# EAGLE design breakout (EAGLE 9.6.2)
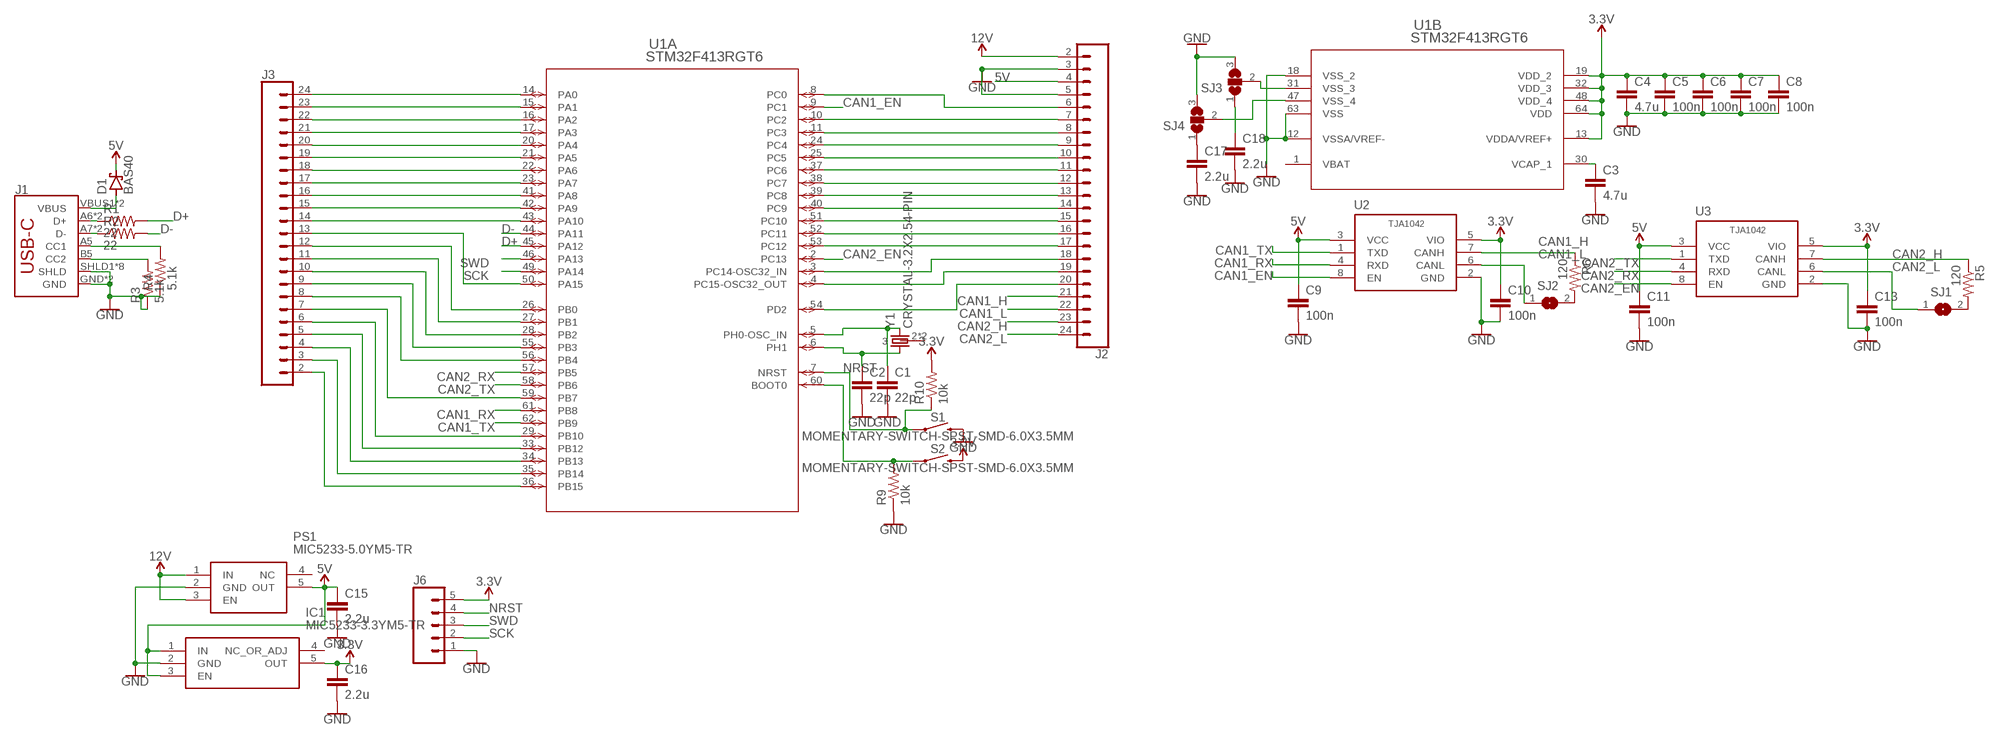
[diagram p0: schematic, sheet 1]

## Parts
C1  22p  C0603  [0603-C]
C2  22p  C0603  [0603-C]
C3  4.7u  C0603  [0603-C]
C4  4.7u  C0603  [0603-C]
C5  100n  C0603  [0603-C]
C6  100n  C0603  [0603-C]
C7  100n  C0603  [0603-C]
C8  100n  C0603  [0603-C]
C9  100n  C0603  [0603-C]
C10  100n  C0603  [0603-C]
C11  100n  C0603  [0603-C]
C13  100n  C0603  [0603-C]
C15  2.2u  C0603  [0603-C]
C16  2.2u  C0603  [0603-C]
C17  2.2u  C0603  [0603-C]
C18  2.2u  C0603  [0603-C]
D1  BAS40  [SOT23]
IC1  MIC5233-3.3YM5-TR  [SOT95P280X145-5N]
J1  USB-C-BREAKOUT_SPARKFUN-CONNECTORS_USB_C16PIN  [USB-C-BREAKOUT_SPARKFUN-CONNECTORS_USB-C-16P]
J2  CONN_23  [1X23]
J3  CONN_23  [1X23]
J6  CONN_05  [1X05]
PS1  MIC5233-5.0YM5-TR  [SOT95P280X145-5N]
R1  22  R0402  [0402-R]
R2  22  R0402  [0402-R]
R3  5.1k  R0402  [0402-R]
R4  5.1k  R0402  [0402-R]
R5  120  R0402  [0402-R]
R6  120  R0402  [0402-R]
R9  10k  R0402  [0402-R]
R10  10k  R0402  [0402-R]
S1  MOMENTARY-SWITCH-SPST-SMD-6.0X3.5MM  [TACTILE_SWITCH_SMD_6.0X3.5MM]
S2  MOMENTARY-SWITCH-SPST-SMD-6.0X3.5MM  [TACTILE_SWITCH_SMD_6.0X3.5MM]
SJ1  SJ  [SJ]
SJ2  SJ  [SJ]
SJ3  SJ2W  [SJ_2]
SJ4  SJ2W  [SJ_2]
U1  STM32F413RGT6  [LQFP64-10X10MM]
U2  TJA1042  [NXP_SEMICONDUCTORS_TJA1042T-3-CM_118_0]
U3  TJA1042  [NXP_SEMICONDUCTORS_TJA1042T-3-CM_118_0]
Y1  CRYSTAL-3.2X2.54-PIN  [XTAL-3.2X2.5]

## Nets
3.3V: C4.1 C5.1 C6.1 C7.1 C8.1 C10.1 C13.1 C16.1 IC1.5(OUT) J6.5 R10.2 S2.2 U1.13(B:VDDA/VREF+) U1.19(B:VDD_2) U1.32(B:VDD_3) U1.48(B:VDD_4) U1.64(B:VDD) U2.5(VIO) U3.5(VIO)
5V: C9.1 C11.1 C15.1 D1.3(C) IC1.1(IN) IC1.3(EN) J2.4 PS1.5(OUT) U2.3(VCC) U3.3(VCC)
12V: J2.2 PS1.1(IN) PS1.3(EN)
CAN1_EN: U1.9(A:PC1) U2.8(EN)
CAN1_H: J2.21 R6.1 U2.7(CANH)
CAN1_L: J2.22 SJ2.1 U2.6(CANL)
CAN1_RX: U1.61(A:PB8) U2.4(RXD)
CAN1_TX: U1.62(A:PB9) U2.1(TXD)
CAN2_EN: U1.2(A:PC13) U3.8(EN)
CAN2_H: J2.23 R5.1 U3.7(CANH)
CAN2_L: J2.24 SJ1.1 U3.6(CANL)
CAN2_RX: U1.57(A:PB5) U3.4(RXD)
CAN2_TX: U1.58(A:PB6) U3.1(TXD)
D+: R1.2 U1.45(A:PA12)
D-: R2.2 U1.44(A:PA11)
GND: C1.2 C2.2 C3.2 C4.2 C5.2 C6.2 C7.2 C8.2 C9.2 C10.2 C11.2 C13.2 C15.2 C16.2 C17.2 C18.2 IC1.2(GND) J1.GND J1.GND2(GND) J1.SHLD1(SHLD) J1.SHLD2(SHLD) J1.SHLD3(SHLD) J1.SHLD4(SHLD) J1.SHLD5(SHLD) J1.SHLD6(SHLD) J1.SHLD7(SHLD) J1.SHLD8(SHLD) J2.3 J2.5 J6.1 PS1.2(GND) R3.1 R4.1 R9.1 S1.2 SJ3.3 SJ4.3 U1.12(B:VSSA/VREF-) U1.18(B:VSS_2) U1.63(B:VSS) U2.2(GND) U3.2(GND)
N$1: C1.1 U1.5(A:PH0-OSC_IN) Y1.3
N$2: C2.1 U1.6(A:PH1) Y1.1
N$3: J3.24 U1.14(A:PA0)
N$4: J3.23 U1.15(A:PA1)
N$5: D1.1(A) J1.VBUS1(VBUS) J1.VBUS2(VBUS)
N$6: J1.A5(CC1) R4.2
N$7: J1.B5(CC2) R3.2
N$8: C17.1 SJ4.1
N$9: R9.2 S2.1 U1.60(A:BOOT0)
N$10: J1.A6(D+) J1.B6(D+) R1.1
N$11: J1.A7(D-) J1.B7(D-) R2.1
N$12: R5.2 SJ1.2
N$13: C3.1 U1.30(B:VCAP_1)
N$14: J3.22 U1.16(A:PA2)
N$15: SJ3.2 U1.31(B:VSS_3)
N$16: SJ4.2 U1.47(B:VSS_4)
N$17: C18.1 SJ3.1
N$18: J3.21 U1.17(A:PA3)
N$19: J3.20 U1.20(A:PA4)
N$20: J3.19 U1.21(A:PA5)
N$21: J3.18 U1.22(A:PA6)
N$22: J3.17 U1.23(A:PA7)
N$23: J3.16 U1.41(A:PA8)
N$24: J3.15 U1.42(A:PA9)
N$25: J3.14 U1.43(A:PA10)
N$26: J3.13 U1.50(A:PA15)
N$27: J3.12 U1.26(A:PB0)
N$28: J3.11 U1.27(A:PB1)
N$29: J3.10 U1.28(A:PB2)
N$30: J3.9 U1.55(A:PB3)
N$31: J3.8 U1.56(A:PB4)
N$32: J3.7 U1.59(A:PB7)
N$33: J3.6 U1.29(A:PB10)
N$34: J3.5 U1.33(A:PB12)
N$35: J3.4 U1.34(A:PB13)
N$36: J3.3 U1.35(A:PB14)
N$37: J3.2 U1.36(A:PB15)
N$38: J2.20 U1.54(A:PD2)
N$39: J2.19 U1.4(A:PC15-OSC32_OUT)
N$40: J2.18 U1.3(A:PC14-OSC32_IN)
N$41: J2.17 U1.53(A:PC12)
N$42: J2.16 U1.52(A:PC11)
N$43: J2.15 U1.51(A:PC10)
N$44: J2.14 U1.40(A:PC9)
N$45: J2.13 U1.39(A:PC8)
N$46: J2.12 U1.38(A:PC7)
N$47: J2.11 U1.37(A:PC6)
N$48: J2.10 U1.25(A:PC5)
N$49: J2.9 U1.24(A:PC4)
N$50: J2.8 U1.11(A:PC3)
N$51: J2.7 U1.10(A:PC2)
N$52: J2.6 U1.8(A:PC0)
N$53: R6.2 SJ2.2
NRST: J6.4 R10.1 S1.1 U1.7(A:NRST)
SCK: J6.2 U1.49(A:PA14)
SWD: J6.3 U1.46(A:PA13)
Unconnected: IC1.4(NC_OR_ADJ) PS1.4(NC) Y1.2 Y1.4

## Power pins joined to a net without a drawn wire
VBAT: U1.1(B:VBAT)

## Library data of the parts
C1-C11 C13 C15-C18 = comma.ai:C
D1 = diode:BAS40: Silicon Schottky Diodes General-purpose diode for high-speed switching
IC1 = SamacSys_Parts:MIC5233-3.3YM5-TR: High Input Voltage Low IQ UCAP LDO Regulator Source: Datasheet <http://ww1.microchip.com/downloads/en/DeviceDoc/MIC5233-Data-Sheet-DS20006033D.pdf>; DESCRIPTION: High Input Voltage Low IQ UCAP LDO Regulator; HEIGHT: 1.45mm; MANUFACTURER_NAME: Microchip; MANUFACTURER_PART_NUMBER: MIC5233-3.3YM5-TR; MOUSER_PART_NUMBER: 998-MIC5233-3.3YM5TR; MOUSER_PRICE-STOCK: https://www.mouser.co.uk/ProductDetail/Microchip-Technology-Micrel/MIC5233-33YM5-TR?qs=U6T8BxXiZAWDhshLMgpaLQ%3D%3D
J1 = ROTR-Wireless:USB-C-BREAKOUT_SPARKFUN-CONNECTORS_USB_C: USB Type C 16Pin Connector Super Speed pins not available on the 16-pin purely SMD connector so this part is best for USB 2.0 implementations. D1 and D2 are tied together enabling D+/- no matter which way the cable is plugged into the connector. The two channel configuration pins (CC1/2) are exposed. These are normally connected to ground via 5.1k resistors but can be reconfigured for high current/high power applications.; PROD_ID: CONN-14122
J2 J3 = SparkFun-Connectors:CONN_23: Multi connection point. Often used as Generic Header-pin footprint for 0.1 inch spaced/style header connections On any of the 0.1 inch spaced packages, you can populate with these: Break Away Headers - Straight <https://www.sparkfun.com/products/116> (PRT-00116) Break Away Male Headers - Right Angle <https://www.sparkfun.com/products/553> (PRT-00553) Female Headers <https://www.sparkfun.com/products/115> (PRT-00115) Break Away Headers - Machine Pin <https://www.sparkfun.com/products/117> (PRT-00117) Break Away Female Headers - Swiss Machine Pin <https://www.sparkfun.com/products/743> (PRT-00743) For SCREWTERMINALS and SPRING TERMINALS visit here: Screw Terimnals on SparkFun.com <https://www.sparkfun.com/search/results?term=Screw+Terminals> (5mm/3.5mm/2.54mm spacing) This device is also useful as a general connection point to wire up your design to another part of your project. Our various solder wires solder well into these plated through hole pads. Hook-Up Wire - Assortment (Stranded, 22 AWG) <https://www.sparkfun.com/products/11375> (PRT-11375) Hook-Up Wire - Assortment (Solid Core, 22 AWG) <https://www.sparkfun.com/products/11367> (PRT-11367) View the entire wire category on our website here <https://www.sparkfun.com/categories/141> Special notes: Molex polarized connector foot print use with SKU : PRT-08231 with associated crimp pins and housings. 1MM SMD Version SKU: PRT-10208 NOTES ON THE VARIANTS LOCK and LOCK_LONGPADS... This footprint was designed to help hold the alignment of a through-hole component (i.e. 6-pin header) while soldering it into place. You may notice that each hole has been shifted either up or down by 0.005 of an inch from it's more standard position (which is a perfectly straight line). This slight alteration caused the pins (the squares in the middle) to touch the edges of the holes. Because they are alternating, it causes a "brace" to hold the component in place. 0.005 has proven to be the perfect amount of "off-center" position when using our standard breakaway headers. Although looks a little odd when you look at the bare footprint, once you have a header in there, the alteration is very hard to notice. Also,if you push a header all the way into place, it is covered up entirely on the bottom side.
J6 = SparkFun-Connectors:CONN_05: Multi connection point. Often used as Generic Header-pin footprint for 0.1 inch spaced/style header connections On any of the 0.1 inch spaced packages, you can populate with these: Break Away Headers - Straight <https://www.sparkfun.com/products/116> (PRT-00116) Break Away Male Headers - Right Angle <https://www.sparkfun.com/products/553> (PRT-00553) Female Headers <https://www.sparkfun.com/products/115> (PRT-00115) Break Away Headers - Machine Pin <https://www.sparkfun.com/products/117> (PRT-00117) Break Away Female Headers - Swiss Machine Pin <https://www.sparkfun.com/products/743> (PRT-00743) For SCREWTERMINALS and SPRING TERMINALS visit here: Screw Terimnals on SparkFun.com <https://www.sparkfun.com/search/results?term=Screw+Terminals> (5mm/3.5mm/2.54mm spacing) This device is also useful as a general connection point to wire up your design to another part of your project. Our various solder wires solder well into these plated through hole pads. Hook-Up Wire - Assortment (Stranded, 22 AWG) <https://www.sparkfun.com/products/11375> (PRT-11375) Hook-Up Wire - Assortment (Solid Core, 22 AWG) <https://www.sparkfun.com/products/11367> (PRT-11367) View the entire wire category on our website here <https://www.sparkfun.com/categories/141> Special notes: Molex polarized connector foot print use with SKU : PRT-08231 with associated crimp pins and housings. 1MM SMD Version SKU: PRT-10208
PS1 = SamacSys_Parts:MIC5233-5.0YM5-TR: MICROCHIP - MIC5233-5.0YM5-TR - LDO, REG, 36VIN, 0.1A, 5V, 2%, 5SOT23 Source: Datasheet <https://componentsearchengine.com/Datasheets/2/MIC5233-5.0YM5-TR.pdf>; DESCRIPTION: MICROCHIP - MIC5233-5.0YM5-TR - LDO, REG, 36VIN, 0.1A, 5V, 2%, 5SOT23; HEIGHT: 1.45mm; MANUFACTURER_NAME: Microchip; MANUFACTURER_PART_NUMBER: MIC5233-5.0YM5-TR; MOUSER_PART_NUMBER: 998-MIC5233-5.0YM5TR; MOUSER_PRICE-STOCK: https://www.mouser.co.uk/ProductDetail/Microchip-Technology-Micrel/MIC5233-50YM5-TR?qs=U6T8BxXiZAWSnpCHgrMajw%3D%3D
R1-R6 R9 R10 = comma.ai:R
S1 S2 = SparkFun-Switches:MOMENTARY-SWITCH-SPST: Momentary Switch (Pushbutton) - SPST Normally-open (NO) SPST momentary switches (buttons, pushbuttons). Variants PTH-12MM - 12mm square, through-hole Momentary Pushbutton Switch - 12mm Square <https://www.sparkfun.com/products/9190> (COM-09190) PTH-6.0MM, PTH-6.0MM-KIT - 6.0mm square, through-hole Mini Pushbutton Switch <https://www.sparkfun.com/products/97> (COM-00097) KIT package intended for soldering kit's - only one side of pads' copper is exposed. PTH-RIGHT-ANGLE-KIT - Right-angle, through-hole Right Angle Tactile Button <https://www.sparkfun.com/products/10791> - Used on SparkFun BigTime Watch Kit <https://www.sparkfun.com/products/11734> SMD-12MM - 12mm square, surface-mount Tactile Button - SMD (12mm) <https://www.sparkfun.com/products/12993> (COM-12993) Used on SparkFun PicoBoard <https://www.sparkfun.com/products/11888> SMD-4.5MM - 4.5mm Square Trackball Switch Used on SparkFun Blackberry Trackballer Breakout <https://www.sparkfun.com/products/13169> SMD-4.6MMX2.8MM - 4.60mm x 2.80mm, surface mount Used on SparkFun SAMD21 Mini Breakout <https://www.sparkfun.com/products/13664> SMD-5.2MM, SMD-5.2-REDUNDANT - 5.2mm square, surface-mount Mini Pushbutton Switch - SMD <https://www.sparkfun.com/products/8720> (COM-08720) Used on Arduino Pro Mini <https://www.sparkfun.com/products/11114> REDUNDANT package connects both switch circuits together SMD-6.0X3.5MM - 6.0 x 3.5mm, surface mount Momentary Reset Switch SMD <https://www.sparkfun.com/products/8229> (COM-08229) SMD-6.2MM-TALL - 6.2mm square, surface mount Tactile Button - SMD (6mm) <https://www.sparkfun.com/products/12992> Used on SparkFun Digital Sandbox <https://www.sparkfun.com/products/12651> SMD-RIGHT-ANGLE - Right-angle, surface mount Used on SparkFun Block for Intel® Edison - Arduino <https://www.sparkfun.com/products/13036>; PROD_ID: SWCH-00815; SF_SKU: COM-08229
SJ1 SJ2 = jumper:SJ: SMD solder JUMPER
SJ3 SJ4 = jumper:SJ2W: SMD solder JUMPER
U1 = interceptor:STM32F413RGT6; BUILT_BY: EMA_UL_Team; COPYRIGHT: Copyright (C) 2018 Accelerated Designs. All rights reserved; MANUFACTURER_PART_NUMBER: STM32F413RGT6; SOURCELIBRARY: Updates_to_database_2020-10-19; VENDOR: STMicroelectronics
U2 U3 = CM,118:TJA1042
Y1 = comma.ai:CRYSTAL-3.2X2.5

## Board
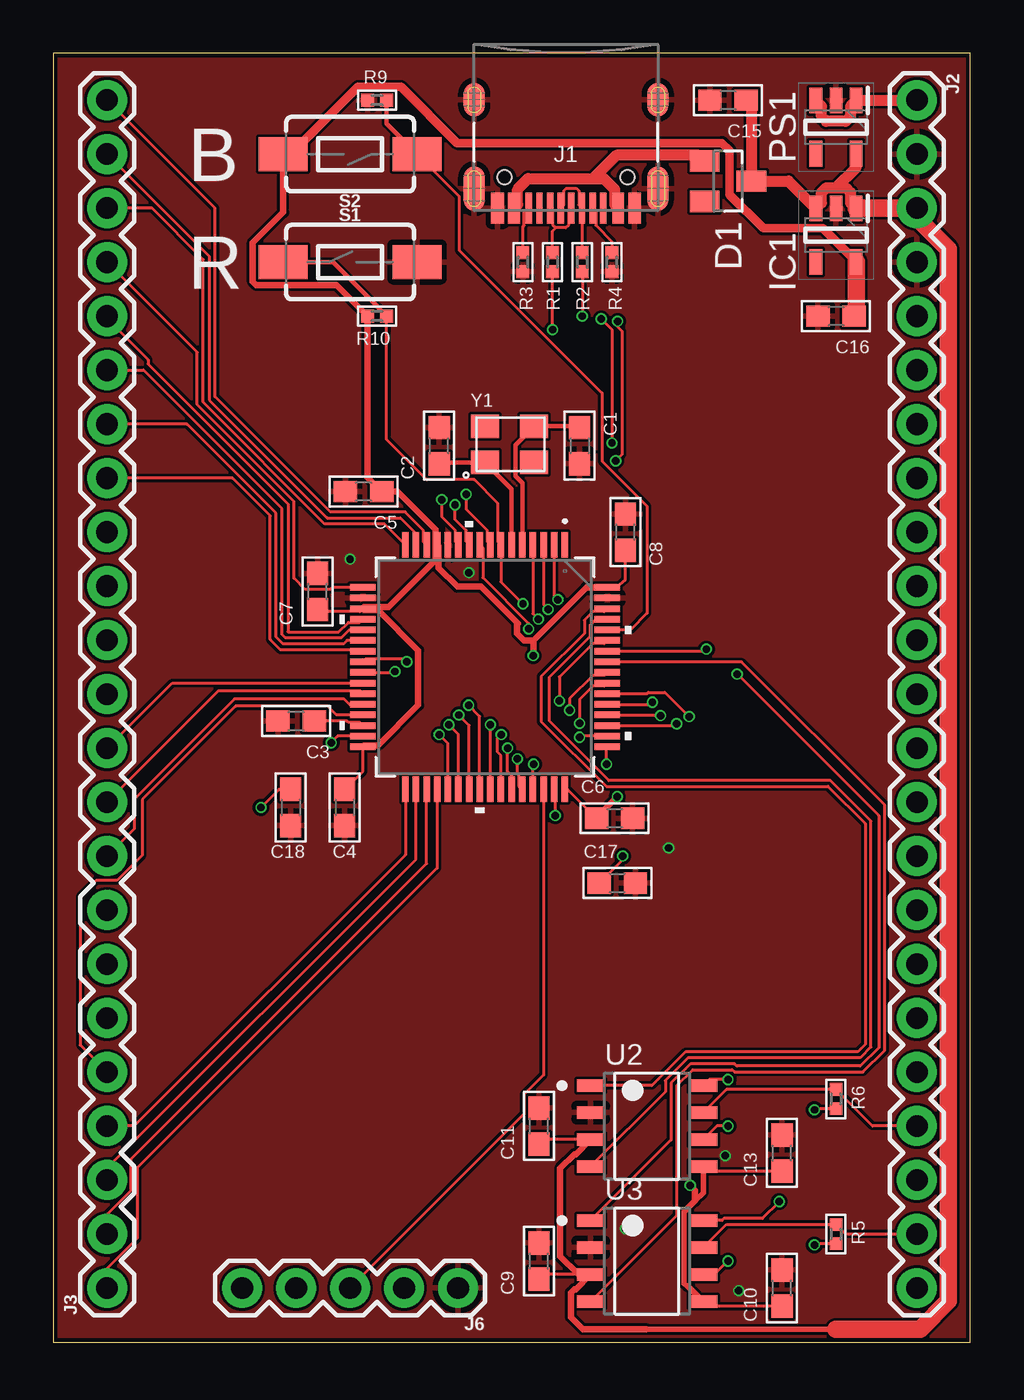
[diagram p1: board, top side]
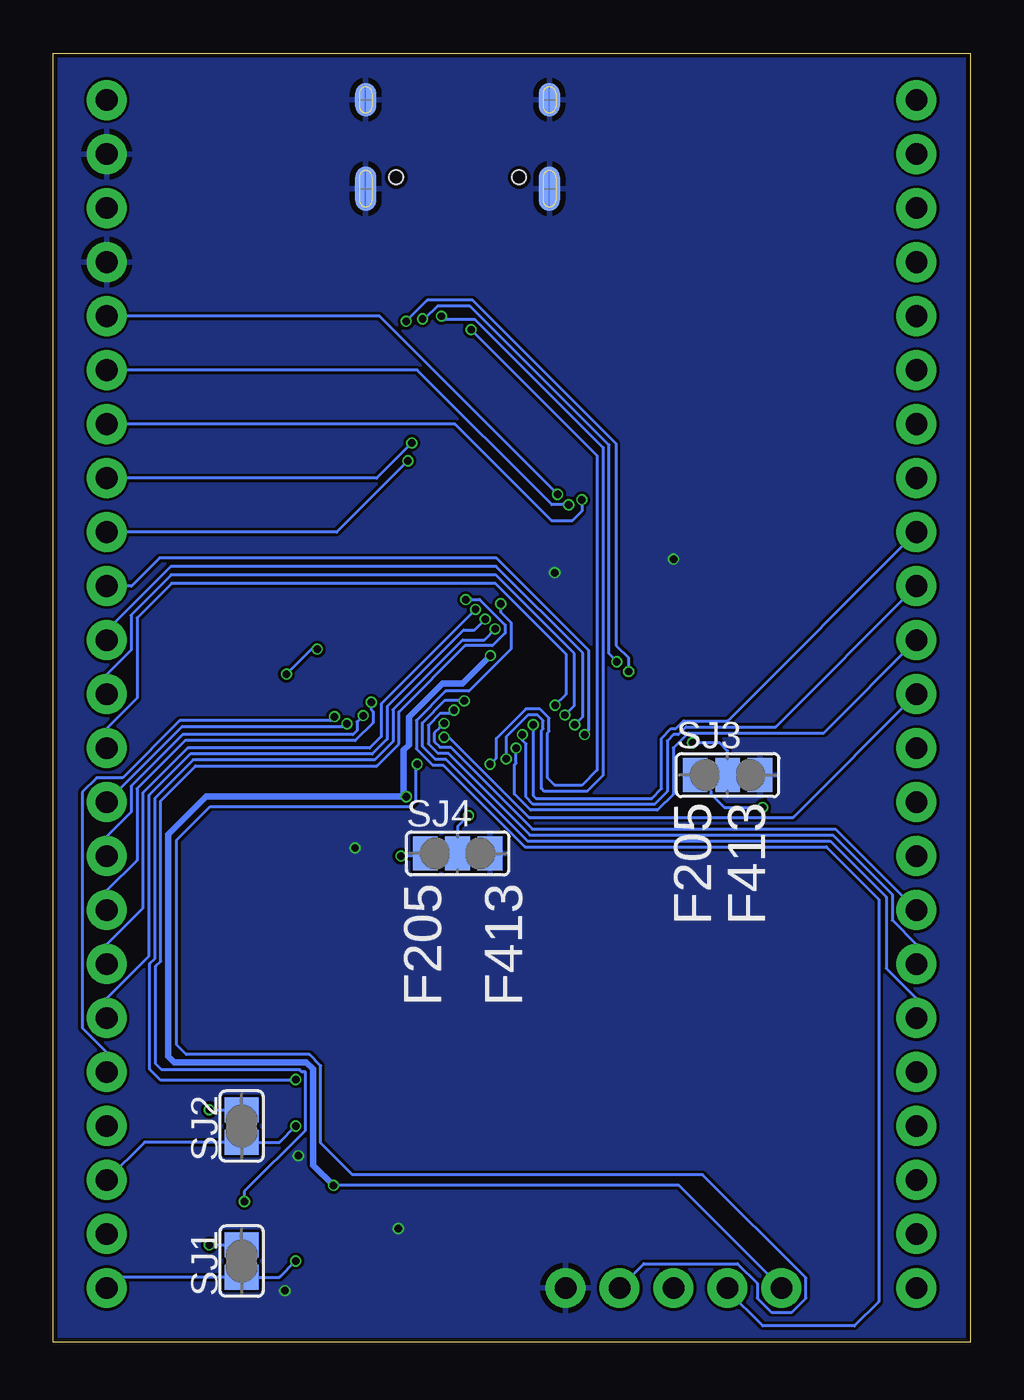
[diagram p2: board, bottom side, seen from below]

Size 43.16 x 60.63 mm. Coordinates in mm from the lower left corner, seen from the top.
Outline: 0,0 43.16,0 43.16,60.63 0,60.63 0,0
Copper layers (1*16): Top 0.035559375mm / dielectric 1.6mm / Bottom 0.035559375mm
Design rules "jlcpcb2layer": minimum track width 5mil, minimum drill 12mil, track to track 5mil, track to pad 5mil, pad to pad 5mil, via to via 5mil, smd to smd 5mil, copper to edge 8mil, drill to drill 6mil, minimum pad ring 5mil, minimum via ring 3mil, stop-mask expansion 2.5mil, vias tented up to drill 0mil, thermal gap 10mil

### Footprints (pad centres in the part's own frame; a part is rotated, then mirrored left to right if it is on the bottom)
0603-C = smd 1.1 x 1: 1 -0.85,0; 2 0.85,0
SOT23 = smd 1 x 1.4: 1 -0.95,-1.1; 2 0.95,-1.1; 3 0,1.1
SOT95P280X145-5N = smd 1.2 x 0.6: 1 -1.25,0.95; 2 -1.25,0; 3 -1.25,-0.95; 4 1.25,-0.95; 5 1.25,0.95
USB-C-BREAKOUT_SPARKFUN-CONNECTORS_USB-C-16P = smd 0.3 x 1.45: A5 -1.25,0; A6 -0.25,0; A7 0.25,0; A8 1.25,0; B5 1.75,0; B6 0.75,0; B7 -0.75,0; B8 -1.75,0 | smd 0.6 x 1.45: GND -3.225,0; GND2 3.225,0 | smd 1 x 2.1: SHLD1 -4.32,-0.915; SHLD2 4.32,-0.915 | smd 1 x 2.1 bottom: SHLD3 -4.32,-0.915; SHLD4 4.32,-0.915 | smd 1 x 1.6: SHLD5 -4.32,-5.095; SHLD8 4.32,-5.095 | smd 1 x 1.6 bottom: SHLD6 -4.32,-5.095; SHLD7 4.32,-5.095 | smd 0.55 x 1.45: VBUS1 -2.45,0; VBUS2 2.45,0 | hole 0.65: -2.89,-1.445; 2.89,-1.445
1X23 = drill 1.016 pad 1.88: 2 -26.67,0; 3 -24.13,0; 4 -21.59,0; 5 -19.05,0; 6 -16.51,0; 7 -13.97,0; 8 -11.43,0; 9 -8.89,0; 10 -6.35,0; 11 -3.81,0; 12 -1.27,0; 13 1.27,0; 14 3.81,0; 15 6.35,0; 16 8.89,0; 17 11.43,0; 18 13.97,0; 19 16.51,0; 20 19.05,0; 21 21.59,0; 22 24.13,0; 23 26.67,0; 24 29.21,0
1X05 = drill 1.016 pad 1.88: 1 0,0; 2 2.54,0; 3 5.08,0; 4 7.62,0; 5 10.16,0
0402-R = smd 0.6 x 0.6: 1 -0.45,0; 2 0.45,0
TACTILE_SWITCH_SMD_6.0X3.5MM = smd 2.3 x 1.6: 1 -3.15,0; 2 3.15,0
SJ = smd 1.168 x 1.6: 1 -0.762,0; 2 0.762,0
SJ_2 = smd 1.168 x 1.6: 1 -1.524,0; 2 0,0; 3 1.524,0
LQFP64-10X10MM = smd 1.194 x 0.305: 1 -5.75,3.75; 2 -5.75,3.25; 3 -5.75,2.75; 4 -5.75,2.25; 5 -5.75,1.75; 6 -5.75,1.25; 7 -5.75,0.75; 8 -5.75,0.25; 9 -5.75,-0.25; 10 -5.75,-0.75; 11 -5.75,-1.25; 12 -5.75,-1.75; 13 -5.75,-2.25; 14 -5.75,-2.75; 15 -5.75,-3.25; 16 -5.75,-3.75; 33 5.75,-3.75; 34 5.75,-3.25; 35 5.75,-2.75; 36 5.75,-2.25; 37 5.75,-1.75; 38 5.75,-1.25; 39 5.75,-0.75; 40 5.75,-0.25; 41 5.75,0.25; 42 5.75,0.75; 43 5.75,1.25; 44 5.75,1.75; 45 5.75,2.25; 46 5.75,2.75; 47 5.75,3.25; 48 5.75,3.75 | smd 0.305 x 1.194: 17 -3.75,-5.75; 18 -3.25,-5.75; 19 -2.75,-5.75; 20 -2.25,-5.75; 21 -1.75,-5.75; 22 -1.25,-5.75; 23 -0.75,-5.75; 24 -0.25,-5.75; 25 0.25,-5.75; 26 0.75,-5.75; 27 1.25,-5.75; 28 1.75,-5.75; 29 2.25,-5.75; 30 2.75,-5.75; 31 3.25,-5.75; 32 3.75,-5.75; 49 3.75,5.75; 50 3.25,5.75; 51 2.75,5.75; 52 2.25,5.75; 53 1.75,5.75; 54 1.25,5.75; 55 0.75,5.75; 56 0.25,5.75; 57 -0.25,5.75; 58 -0.75,5.75; 59 -1.25,5.75; 60 -1.75,5.75; 61 -2.25,5.75; 62 -2.75,5.75; 63 -3.25,5.75; 64 -3.75,5.75
NXP_SEMICONDUCTORS_TJA1042T-3-CM_118_0 = smd 1.3 x 0.6: 1 -2.65,1.905; 2 -2.65,0.635; 3 -2.65,-0.635; 4 -2.65,-1.905; 5 2.65,-1.905; 6 2.65,-0.635; 7 2.65,0.635; 8 2.65,1.905
XTAL-3.2X2.5 = smd 1.3 x 1.1: 1 0,-1.8; 2 2.3,-1.8; 3 2.3,-0.1; 4 0,-0.1

### Placement (x,y rotation side)
C1  24.77,42.16 270 top
C2  18.16,42.16 90 top
C3  11.43,29.21 180 top
C4  13.72,25.15 270 top
C5  14.61,40.01 180 top
C6  26.42,24.64 0 top
C7  12.45,35.31 90 top
C8  26.92,38.1 90 top
C9  22.86,3.81 90 top
C10  34.29,2.54 90 top
C11  22.86,10.16 90 top
C13  34.29,8.89 90 top
C15  31.75,58.42 180 top
C16  36.83,48.26 180 top
C17  26.54,21.59 0 top
C18  11.18,25.15 270 top
D1  31.75,54.61 270 top
IC1  36.83,52.07 270 top
J1  24.13,53.34 180 top
J2  40.64,31.75 270 top
J3  2.54,29.21 90 top
J6  19.05,2.54 180 top
PS1  36.83,57.15 270 top
R1  23.5,50.8 270 top
R2  24.89,50.8 270 top
R3  22.1,50.8 90 top
R4  26.29,50.8 90 top
R5  36.83,5.08 270 top
R6  36.83,11.43 270 top
R9  15.24,58.42 0 top
R10  15.24,48.26 180 top
S1  13.97,50.8 0 top
S2  13.97,55.88 180 top
SJ1  34.29,3.81 90 bottom
SJ2  34.29,10.16 90 bottom
SJ3  11.43,26.67 0 bottom
SJ4  24.13,22.99 0 bottom
U1  20.32,31.75 270 top
U2  27.94,10.16 0 top
U3  27.94,3.81 0 top
Y1  20.32,43.18 0 top

### Tracks (layer width: path | path; a pad name or v marks a point on that pad's centre or on a via)
3.3V  (via drill 0.35)
  Top 0.152: U1.19 14.43,34.36 12.55,34.36 C7.1 | C4.1 14.57,26.85 U1.32 | U1.64 26.48,35.5 26.92,35.87 C8.1 | C10.1 30.8,1.69 U3.5 | C13.1 30.8,8.04 U2.5 | C6.1 24.2,26 U1.48
  Top 0.254: U3.5 29.87,2.62 29.84,2.62 29.69,2.77 29.69,6.12 30.2,6.63 30.59,7.02 U2.5
  Top 0.305: U1.32 14.64,28.07 15.28,28.07 17.18,29.96 17.18,32.54 15.28,34.43 14.64,34.43 U1.19 14.64,34.57 15.78,34.57 18,36.79 18,37.43 U1.13 | U1.13 18,37.57 18,38.21 16.21,40.01 C5.1 14.79,40.67 R10.2 13.33,49.72 9.55,49.72 9.39,49.88 9.39,51.72 10.82,53.15 S2.2 | U1.13 18.14,37.43 18.14,36.41 19.02,35.53 20.14,35.53 21.86,33.8 21.82,33.77 21.82,33.32 22.14,33 22.59,33 | U1.64 25.09,35.5 22.59,33 | 30.2,6.63 30.2,7.14 v29.97,7.37 | v26.54,25.65 25.57,24.68 C6.1 | v22.59,32.29 22.59,33
  Top 0.406: IC1.5 36.21,52.39 33.4,52.39 31.82,53.97 31.82,56.06 31.47,56.41 19.01,56.41 16.37,59.05 14.35,59.05 11.18,55.88 S2.2
  Top 0.813: IC1.5 37.78,48.36 C16.1
  Bottom 0.152: J6.5 13.72,7.37 v29.97,7.37
  Bottom 0.305: v29.97,7.37 30.93,8.32 30.93,12.85 31.25,13.17 37.47,13.17 37.74,13.45 37.74,23.88 35.97,25.65 v26.54,25.65 26.67,25.78 26.67,27.85 26.42,28.1 26.42,29.39 24.84,30.98 23.9,30.98 v22.59,32.29
5V
  Top 0.152: U3.3 24.71,3.17 23.07,3.17 C9.1 | U2.3 23.07,9.53 C11.1
  Top 0.254: 27.89,0.61 36.83,0.61
  Top 0.305: 27.89,0.61 24.92,0.61 24.36,1.17 24.36,2.32 24.52,2.48 24.6,2.48 U3.3 | U2.3 24.6,8.83 24.52,8.83 23.85,8.16 23.85,4.03 24.71,3.17
  Top 0.508: 36.83,54.3 36.37,54.3 36.15,54.08 36.15,53.59 IC1.3 34.59,54.61 D1.3 32.85,58.17 C15.1 | 36.83,54.3 37.29,54.3 37.51,54.08 37.51,53.59 IC1.1 | 36.83,54.3 37.78,55.25 PS1.5
  Top 0.813: IC1.1 37.8,53.34 J2.4 40.64,52.88 42.11,51.41 42.11,1.93 40.79,0.61 36.83,0.61
12V
  Top 0.508: J2.2 37.8,58.42 PS1.1 37.51,58.13 37.51,57.64 37.29,57.42 36.37,57.42 36.15,57.64 36.15,58.13 PS1.3
CAN1_EN  (via drill 0.35)
  Top 0.152: U1.9 20.21,37.36 20.21,35.96 22.37,33.8 v22.37,33.54 | v31.75,12.35 30.87,12.35 U2.8
  Bottom 0.152: v22.37,33.54 22.87,33.03 23.89,33.03 27.17,29.75 27.17,28.25 28.04,27.38 36.58,27.38 38.38,25.58 38.38,18.03 38.61,17.8 38.61,12.83 38.1,12.32 31.78,12.32 v31.75,12.35
CAN1_H
  Top 0.152: J2.21 38.55,10.16 R6.1 31.68,11.88 U2.7
CAN1_L  (via drill 0.35)
  Top 0.152: v31.75,10.16 31.23,10.16 U2.6
  Bottom 0.152: J2.22 38.86,9.4 SJ2.1 32.51,9.4 v31.75,10.16
CAN1_RX
  Top 0.152: U1.61 25.53,34 25.27,33.74 25.27,33.21 23.35,31.29 23.35,29.2 26.14,26.42 36.58,26.42 38.48,24.51 38.48,13.88 37.97,13.37 29.87,13.37 28.8,12.3 28.8,11.76 U2.4
CAN1_TX
  Top 0.152: U1.62 25.93,34.36 25.39,34.36 24.99,33.96 24.99,33.33 22.96,31.3 22.96,29.2 26.02,26.14 36.45,26.14 38.2,24.38 38.2,14 37.85,13.65 29.75,13.65 28.17,12.06 U2.1
CAN2_EN  (via drill 0.35)
  Top 0.152: v23.75,34.92 23.57,35.1 U1.2 | v34.16,6.6 33.37,5.81 31.56,5.81 31.46,5.71 U3.8
  Bottom 0.152: v23.75,34.92 23.49,34.92 23.48,34.93 23.09,34.93 21.9,33.73 21.9,33.35 22.5,32.75 23.77,32.75 26.89,29.64 26.89,28.13 27.92,27.1 36.46,27.1 38.1,25.46 38.1,17.91 38.33,17.68 38.33,13.08 38.06,12.81 31.56,12.81 31.45,12.7 31.28,12.7 31.28,9.97 34.16,7.09 v34.16,6.6
CAN2_H
  Top 0.152: J2.23 37.28,5.08 R5.1 31.68,5.53 U3.7
CAN2_L  (via drill 0.35)
  Top 0.152: v31.75,3.81 31.11,3.17 U3.6
  Bottom 0.152: J2.24 40.13,3.05 SJ1.1 32.51,3.05 v31.75,3.81
CAN2_RX
  Top 0.152: U3.4 29.36,5.97 29.36,12.07 30.1,12.81 31.94,12.81 32.05,12.7 38.1,12.7 39.12,13.72 39.12,25.27 32.39,32 U1.57
CAN2_TX  (via drill 0.35)
  Top 0.152: U1.58 30.64,32.5 v30.73,32.59 | v32.18,31.42 38.84,24.77 38.84,13.84 37.97,12.98 32.17,12.98 32.06,13.09 29.98,13.09 29.08,12.18 29.08,9.5 U3.1
  Bottom 0.152: v32.18,31.42 31.01,32.59 v30.73,32.59
D+  (via drill 0.35)
  Top 0.152: U1.45 22.57,27.14 v22.61,27.18 | v23.5,47.62 R1.2
  Bottom 0.152: v23.5,47.62 17.57,41.7 17.57,26.91 18.29,26.19 19.56,26.19 19.91,26.54 19.91,28.65 19.83,28.73 19.83,29.35 20.27,29.79 20.93,29.79 22.31,28.4 22.31,27.47 v22.61,27.18
D-  (via drill 0.35)
  Top 0.152: U1.44 21.93,26.14 21.93,26.68 21.84,26.76 v21.84,27.43 | R2.2 v24.89,48.26
  Bottom 0.152: v24.89,48.26 24.72,48.09 23.3,48.09 17.29,42.08 17.29,26.65 18.03,25.91 20.07,25.91 20.19,26.04 20.19,28.76 20.11,28.85 20.11,29.23 20.38,29.51 20.81,29.51 21.84,28.47 v21.84,27.43
GND  (via drill 0.35)
  other vias: 13.97,36.83 19.56,36.2 32.26,2.41 31.62,8.76 26.92,5.33 28.96,23.24
  pour Top: 0,0 43.18,0 43.18,60.58 0,60.58
  pour Bottom: 0,0 43.18,0 43.18,60.58 0,60.58
N$1
  Top 0.203: C1.1 24.7,43.08 Y1.3 21.74,42.2 21.74,40.73 22.07,40.41 U1.5
N$2
  Top 0.203: C2.1 18.23,41.38 Y1.1 21.57,40.13 U1.6
N$3
  Top 0.152: U1.14 17.43,37.64 17.43,38.18 16.56,39.05 13.04,39.05 7.62,44.47 7.62,53.34 J3.24
N$4
  Top 0.152: J3.23 7.34,51.08 7.34,44.32 12.89,38.77 16.34,38.77 17.07,38.04 U1.15
N$5
  Top 0.508: J1.VBUS1 26.41,53.51 26.41,54.22 25.91,54.73 25.4,54.73 | J1.VBUS2 21.85,53.51 21.85,54.22 22.35,54.73 25.4,54.73 | D1.1 30.39,55.82 26.5,55.82 25.4,54.73
N$6
  Top 0.152: J1.A5 25.53,53.19 25.53,52.53 26.29,51.77 R4.2
N$7
  Top 0.152: R3.2 22.1,52.47 22.16,52.53 22.16,53.12 J1.B5
N$8  (via drill 0.35)
  Top 0.152: v26.8,22.86 26.8,22.69 C17.1
  Bottom 0.152: SJ4.1 25.78,22.86 v26.8,22.86
N$9
  Top 0.152: S2.1 19.11,53.89 19.11,51.35 25.82,44.64 25.82,41.44 27.94,39.32 27.94,34.29 27.15,33.5 U1.60
  Top 0.203: S2.1 15.69,57.31 R9.2
N$10
  Top 0.152: 23.65,52.41 24.11,52.41 24.23,52.53 24.23,53.19 J1.A6 | 23.65,52.41 23.53,52.53 23.53,53.19 J1.B6 | R1.1 23.5,52.26 23.65,52.41
N$11
  Top 0.152: J1.A7 24.03,53.49 24.03,54.15 24.15,54.27 24.61,54.27 24.73,54.15 24.73,53.49 J1.B7 24.89,53.33 R2.1
N$12  (via drill 0.35)
  Top 0.152: R5.2 35.87,4.63 v35.81,4.57
  Bottom 0.152: v35.81,4.57 SJ1.2
N$13
  Top 0.152: U1.30 14.43,29.14 13.89,29.14 13.82,29.21 C3.1
N$14
  Top 0.152: U1.16 15.58,38.49 12.78,38.49 7.06,44.2 7.06,50.93 4.65,53.34 J3.22
N$15  (via drill 0.35)
  Top 0.152: U1.31 13.39,28.5 v13.08,28.19
  Bottom 0.152: SJ3.2 11.43,27.81 11.81,28.19 v13.08,28.19
N$16  (via drill 0.35)
  Top 0.152: v23.62,24.77 23.62,25.95 U1.47
  Bottom 0.152: v23.62,24.77 24.13,24.26 SJ4.2
N$17  (via drill 0.35)
  Top 0.152: v9.78,25.15 10.63,26 C18.1
  Bottom 0.152: SJ3.1 12.22,25.93 12.22,25.79 11.58,25.15 v9.78,25.15
N$18
  Top 0.152: J3.21 6.78,46.56 6.78,44.09 11.33,39.54 11.33,35.94 11.86,35.4 13.03,35.4 13.13,35.5 U1.17
N$19
  Top 0.152: J3.20 2.54,48.13 4.47,46.2 4.47,46.01 11.05,39.43 11.05,33.4 13.43,33.4 13.89,33.86 14.43,33.86 U1.20
N$20
  Top 0.152: J3.19 4.25,45.72 10.77,39.2 10.77,33.28 10.93,33.12 13.55,33.12 13.93,33.5 U1.21
N$21
  Top 0.152: U1.22 13.82,33 13.67,32.84 10.82,32.84 10.49,33.17 10.49,38.99 6.3,43.18 J3.18
N$22
  Top 0.152: U1.23 14.51,32.56 10.7,32.56 10.21,33.05 10.21,38.87 8.44,40.64 J3.17
N$23  (via drill 0.35)
  Top 0.152: U1.41 v20.57,29.04
  Bottom 0.152: J3.16 11.42,29.22 13.51,29.22 13.87,28.85 14.09,28.85 14.54,28.4 14.54,26.04 15,25.58 20.45,25.58 20.57,25.7 v20.57,29.04
N$24  (via drill 0.35)
  Top 0.152: U1.42 21.07,27.59 20.91,27.75 20.91,28.41 v21.08,28.57
  Bottom 0.152: J3.15 9.16,28.94 13.39,28.94 13.75,28.57 13.97,28.57 14.26,28.28 14.26,25.91 14.87,25.3 20.57,25.3 20.91,25.64 20.91,28.13 21.08,28.3 v21.08,28.57
N$25  (via drill 0.35)
  Top 0.152: U1.43 21.57,26.64 21.38,26.83 v21.38,27.94
  Bottom 0.152: J3.14 6.9,28.66 13.27,28.66 13.98,27.95 13.98,25.77 14.73,25.02 20.7,25.02 21.46,25.78 21.46,27.15 21.38,27.24 v21.38,27.94
N$26  (via drill 0.35)
  Top 0.152: U1.50 24.82,28.5 v24.77,28.45
  Bottom 0.152: v24.77,28.45 24.54,28.45 20.77,24.68 8.34,24.68 J3.13
N$27
  Top 0.152: J3.12 5.6,31 U1.26
N$28
  Top 0.152: J3.11 7.77,30.63 14.44,30.63 U1.27
N$29
  Top 0.152: J3.10 3.81,24.13 3.81,25.53 8.54,30.25 13.68,30.25 13.94,30 U1.28
N$30  (via drill 0.35)
  Top 0.152: U1.55 25.93,30.86 25.39,30.86 24.77,30.23 v24.77,29.1
  Bottom 0.152: v24.77,29.1 24.95,28.91 24.96,28.91 25.23,28.64 25.23,28.25 24.96,27.98 24.46,27.98 20.61,24.13 6.35,24.13 J3.9
N$31  (via drill 0.35)
  Top 0.152: U1.56 25.93,31.36 25.39,31.36 24.3,30.27 v24.3,29.72
  Bottom 0.152: v24.3,29.72 24.45,29.57 24.96,29.57 25.51,29.01 25.51,28.14 25.07,27.7 24.58,27.7 20.73,23.85 6.48,23.85 3.68,21.06 3.68,19.85 2.54,18.7 J3.8
N$32  (via drill 0.35)
  Top 0.152: U1.59 25.93,32.86 25.39,32.86 23.82,31.28 v23.82,30.16
  Bottom 0.152: v23.82,30.16 24.08,30.16 24.11,30.18 24.73,30.18 25.79,29.13 25.79,28.02 25.19,27.42 24.7,27.42 20.84,23.57 6.6,23.57 3.96,20.93 3.96,17.59 2.54,16.16 J3.7
N$33
  Top 0.152: U1.29 13.33,29.5 12.91,29.91 8.59,29.91 4.19,25.51 4.19,22.89 3.01,21.72 2.03,21.72 1.27,20.95 1.27,13.97 J3.6
N$34
  Top 0.152: U1.33 16.57,22.92 3.81,10.16 J3.5
N$35
  Top 0.152: U1.34 17.07,22.71 2.54,8.18 J3.4
N$36
  Top 0.152: U1.35 17.57,22.51 3.68,8.62 3.68,7.15 2.54,6 J3.3
N$37
  Top 0.152: U1.36 18.07,22.3 3.96,8.19 3.96,4.89 2.54,3.46 J3.2
N$38  (via drill 0.35)
  Top 0.152: U1.54 27.94,30.5 28,30.57 28.78,30.57 v29.92,29.42
  Bottom 0.152: v29.92,29.42 30.11,29.23 37.2,29.23 39.89,26.54 41.11,26.54 41.78,25.87 41.78,14.77 40.64,13.62 J2.20
N$39  (via drill 0.35)
  Top 0.152: v22.83,34 22.57,34.26 U1.4
  Bottom 0.152: v22.83,34 23.34,33.49 23.84,33.49 27.45,29.89 27.45,28.36 28.15,27.66 36.71,27.66 38.66,25.72 38.66,18.14 40.64,16.16 J2.19
N$40  (via drill 0.35)
  Top 0.152: v23.29,34.46 23.07,34.68 U1.3
  Bottom 0.152: v23.29,34.46 27.73,30.02 27.73,28.48 28.27,27.94 36.83,27.94 38.94,25.83 38.94,20.41 40.64,18.7 J2.18
N$41  (via drill 0.35)
  Top 0.152: U1.53 28.09,30 v28.19,30.1
  Bottom 0.152: v28.19,30.1 28.19,29.74 28.11,29.66 28.11,29.13 28.94,28.3 36.95,28.3 39.22,26.03 39.22,22.67 40.64,21.24 J2.17
N$42  (via drill 0.35)
  Top 0.152: U1.52 28.54,29.5 v28.57,29.47
  Bottom 0.152: v28.57,29.47 28.87,29.17 28.87,28.76 29.06,28.57 37.07,28.57 39.5,26.15 39.5,24.93 40.64,23.78 J2.16
N$43  (via drill 0.35)
  Top 0.152: U1.51 29.25,29 v29.34,29.08
  Bottom 0.152: v29.34,29.08 29.46,28.96 37.08,28.96 J2.15
N$44  (via drill 0.35)
  Top 0.152: v19.54,29.96 20.07,29.43 U1.40
  Bottom 0.152: v19.54,29.96 19.04,30.47 19.04,32.37 22.35,35.69 37.59,35.69 39.22,34.06 39.22,30.29 40.64,28.86 J2.14
N$45  (via drill 0.35)
  Top 0.152: v19.08,29.5 19.57,29.01 U1.39
  Bottom 0.152: v19.08,29.5 | v19.08,29.5 18.64,29.94 18.64,32.39 22.34,36.09 37.61,36.09 39.5,34.2 39.5,32.55 40.64,31.4 J2.13
N$46  (via drill 0.35)
  Top 0.152: v18.62,29.04 19.07,28.59 U1.38
  Bottom 0.152: v18.62,29.04 | v18.62,29.04 18.24,29.42 18.24,32.4 22.32,36.48 37.62,36.48 40.64,33.47 J2.12
N$47  (via drill 0.35)
  Top 0.152: v18.16,28.57 18.57,28.17 U1.37
  Bottom 0.152: v18.16,28.57 | v18.16,28.57 17.96,28.77 17.96,32.54 22.3,36.88 38.15,36.88 39.47,35.56 J2.11
N$48  (via drill 0.35)
  Top 0.152: U1.25 16.04,31.5 v16.08,31.54 | v26.55,48.02 26.55,47.75 26.75,47.55 26.75,41.74 v26.47,41.45
  Bottom 0.152: v16.08,31.54 16.08,32.18 16.68,32.77 16.68,42.26 23.43,49.01 25.57,49.01 v26.55,48.02 | v26.47,41.45 29.82,38.1 J2.10
N$49  (via drill 0.35)
  Top 0.152: U1.24 14.7,32.13 16.51,32.13 v16.64,32 | v25.78,48.13 26.29,47.62 v26.29,42.29
  Bottom 0.152: v16.64,32 17.01,32.38 17.01,42.19 23.54,48.73 25.09,48.73 25.68,48.13 v25.78,48.13 | v26.29,42.29 27.94,40.64 J2.9
N$50  (via drill 0.35)
  Top 0.152: U1.11 18.93,37.64 18.93,38.18 18.29,38.82 v18.29,39.62
  Bottom 0.152: v18.29,39.62 18.29,39.08 18.74,38.62 19.7,38.62 24.26,43.18 J2.8
N$51  (via drill 0.35)
  Top 0.152: U1.10 19.43,37.64 19.43,38.18 18.91,38.7 v18.91,39.39
  Bottom 0.152: v18.91,39.39 19.7,39.39 26.04,45.72 J2.7
N$52  (via drill 0.35)
  Top 0.152: U1.8 20.43,37.64 20.43,38.18 19.43,39.18 v19.43,39.88
  Bottom 0.152: v19.43,39.88 27.81,48.26 J2.6
N$53  (via drill 0.35)
  Top 0.152: R6.2 35.87,10.98 v35.81,10.92
  Bottom 0.152: v35.81,10.92 SJ2.2
NRST  (via drill 0.35)
  Top 0.152: R10.1 15.69,42.45 17.58,40.56 19.82,40.56 20.93,39.45 20.93,37.64 U1.7 21.07,35.76 v22.1,34.73
  Top 0.203: R10.1 15.32,48.63 15.32,48.66 13.17,50.8 S1.1
  Bottom 0.152: v22.1,34.73 22.1,34.33 21.62,33.85 21.62,32.6 23.59,30.62 24.69,30.62 26.07,29.25 26.07,27.91 25.3,27.14 24.81,27.14 20.96,23.29 6.78,23.29 4.32,20.83 4.32,1.91 5.46,0.76 9.78,0.76 11.43,2.41 J6.4
SCK  (via drill 0.35)
  Top 0.152: v26.04,27.18 26.04,27.96 U1.49
  Bottom 0.152: J6.2 15.37,3.68 10.96,3.68 10.03,2.76 10.03,2.07 9.36,1.4 8.42,1.4 7.75,2.07 7.75,3.01 12.61,7.87 29.08,7.87 30.57,9.36 30.57,12.99 31.1,13.52 36.89,13.52 37.34,13.97 37.34,23.62 35.77,25.19 26.35,25.19 26.08,25.46 26.08,27.14 v26.04,27.18
SWD
  Top 0.152: J6.3 22.16,10.73 22.16,11.64 23.07,12.56 U1.46

### Text on the board
tNames: B | R
bNames: F413 | F205 | F413 | F205
bValues: PA0 | 12V | PA1 | GND | PA2 | 5V | PA3 | GND | PA4 | PC0 | PA5 | PC2 | PA6 | PC3 | PA7 | PC4 | PA8 | PC5 | PA9 | PC6 | PA10 | PC7 | PA15 | PC8 | PB0 | PC9 | PB1 | PC10 | PB2 | PC11 | PB3 | PC12 | PB4 | PC14 | PB7 | PC15 | PB10 | PD2 | NRST | 1H | SWD | GND | PB12 | 3V3 | SCK | 1L | PB13 | PB14 | 2H | 15 | 2L